# Altium schematic sheet MODELO TRANSFORMADOR.SCHDOC
size A
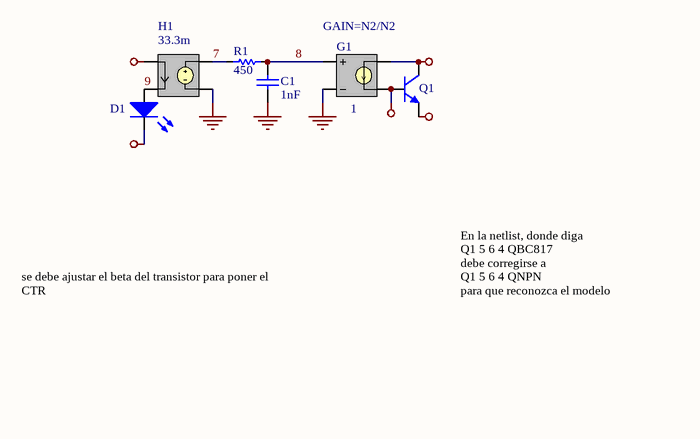
[diagram p0: MODELO TRANSFORMADOR.SCHDOC]

## Parts
C1  value 1nF  [0805]  (hidden comment: Cap)
D1  LED  [LED3mm]  (value not drawn)
G1  Gain: 1  (hidden comment: GSRC)
H1  Gain: 33.3m  (hidden comment: HSRC)
Q1  NPN  [SOT23]  (value not drawn)
R1  value 450  [0805]  (hidden comment: Res)

## Nets
1: H1.1(NC+)
2: D1.2(K)
4: Q1.2(E)
5: G1.3(N+) Q1.3(C)
6: G1.4(N-) Q1.1(B)
GND: C1.2 G1.2(NC-) H1.4(N-)
7: H1.3(N+) R1.1
8: C1.1 G1.1(NC+) R1.2
9: D1.1(A) H1.2(NC-)

## Notes on the sheet
- (near G1) GAIN=N2/N2
- En la netlist, donde diga
  Q1 5 6 4 QBC817
  debe corregirse a
  Q1 5 6 4 QNPN
  para que reconozca el modelo
- se debe ajustar el beta del transistor para poner el CTR

## Library data of the parts
C1 = Cap: Capacitor; Voltage: 50V; Price: 0.25; Technology: Ceramic
D1 = LED: Color: Green; Price: ?
G1 = GSRC: Voltage Controlled Current Source; Note: PCB Footprint - Not required; Published: 8-Jun-2000; Revision: 17-Jul-2002: Re-released for DXP Platform.; Package Reference: Not Applicable; Publisher: Altium Limited
H1 = HSRC: Current Controlled Voltage Source; Note: PCB Footprint - Not required; Published: 8-Jun-2000; Revision: 17-Jul-2002: Re-released for DXP Platform.; Package Reference: Not Applicable; Publisher: Altium Limited
Q1 = BC817: NPN Bipolar Transistor; Price: 0.38
R1 = Res: Resistor; Power: 0.25W; Price: 0.036